# EAGLE design TapuinoNext (EAGLE 9.6.2)
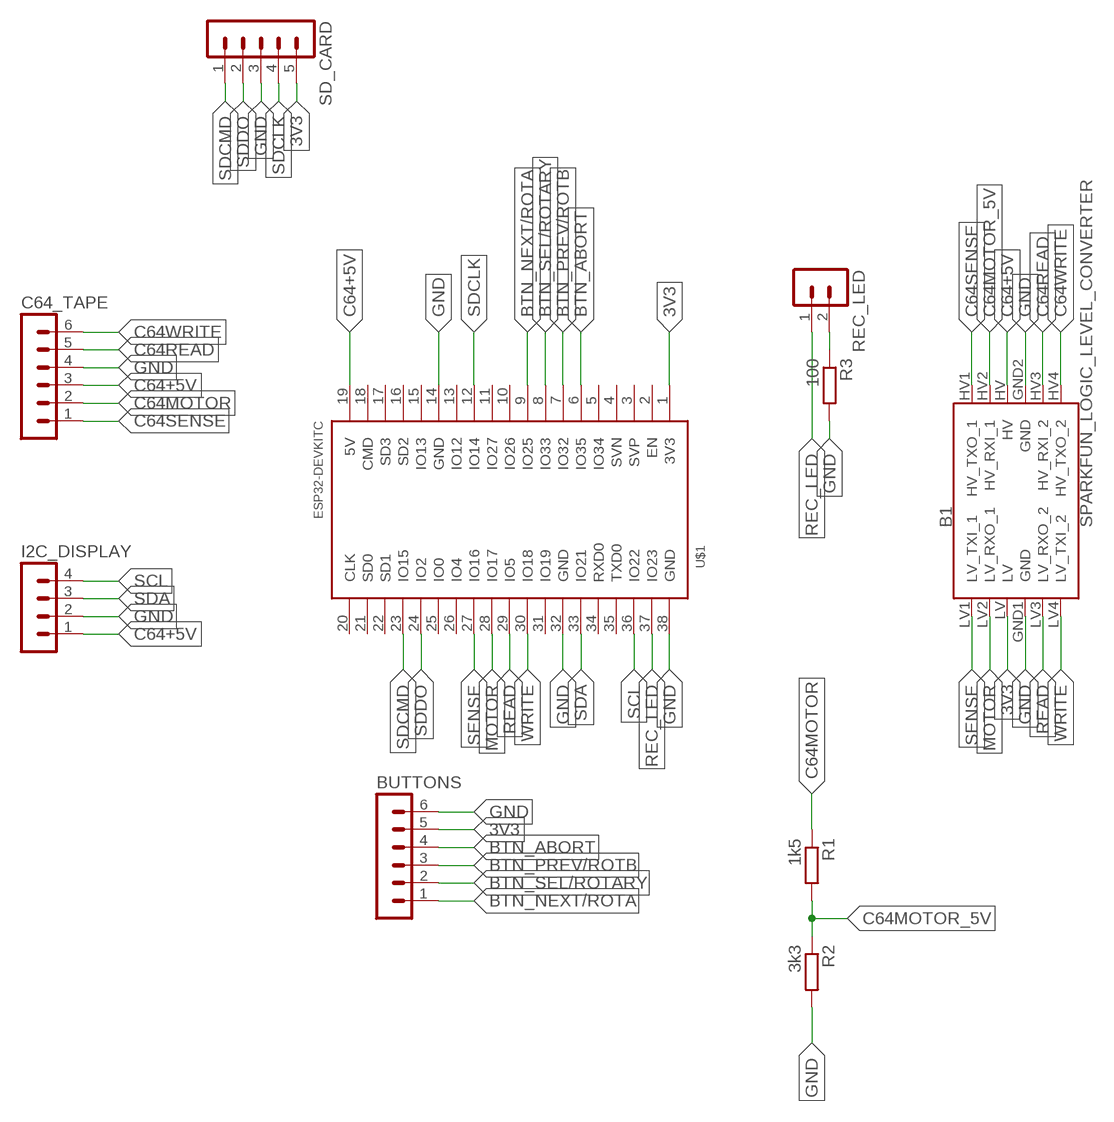
[diagram p0: schematic, sheet 1]

## Parts
B1  SPARKFUN_LOGIC_LEVEL_CONVERTER  [SPARKFUN_LOGIC_LEVEL_CONVERTER]
BUTTONS  MA06-1  [MA06-1]
C64_TAPE  MA06-1  [MA06-1]
I2C_DISPLAY  MA04-1  [MA04-1]
R1  1k5  R-EU_0204/7  [0204/7]
R2  3k3  R-EU_0204/7  [0204/7]
R3  100  R-EU_0204/7  [0204/7]
REC_LED  MA02-1  [MA02-1]
SD_CARD  MA05-1  [MA05-1]
U$1  ESP32DEVKITC  [ESP32-DEVKITC]

## Nets
3V3: B1.LV BUTTONS.5 SD_CARD.5 U$1.1(3V3)
BTN_ABORT: BUTTONS.4 U$1.6(IO35)
BTN_NEXT/ROTA: BUTTONS.1 U$1.9(IO25)
BTN_PREV/ROTB: BUTTONS.3 U$1.7(IO32)
BTN_SEL/ROTARY: BUTTONS.2 U$1.8(IO33)
C64+5V: B1.HV C64_TAPE.3 I2C_DISPLAY.1 U$1.19(5V)
C64MOTOR: C64_TAPE.2 R1.1
C64MOTOR_5V: B1.HV2(HV_RXI_1) R1.2 R2.1
C64READ: B1.HV3(HV_RXI_2) C64_TAPE.5
C64SENSE: B1.HV1(HV_TXO_1) C64_TAPE.1
C64WRITE: B1.HV4(HV_TXO_2) C64_TAPE.6
GND: B1.GND1(GND) B1.GND2(GND) BUTTONS.6 C64_TAPE.4 I2C_DISPLAY.2 R2.2 R3.2 SD_CARD.3 U$1.14(GND) U$1.32(GND) U$1.38(GND)
MOTOR: B1.LV2(LV_RXO_1) U$1.28(IO17)
N$2: R3.1 REC_LED.2
READ: B1.LV3(LV_RXO_2) U$1.29(IO5)
REC_LED: REC_LED.1 U$1.37(IO23)
SCL: I2C_DISPLAY.4 U$1.36(IO22)
SDA: I2C_DISPLAY.3 U$1.33(IO21)
SDCLK: SD_CARD.4 U$1.12(IO14)
SDCMD: SD_CARD.1 U$1.23(IO15)
SDDO: SD_CARD.2 U$1.24(IO2)
SENSE: B1.LV1(LV_TXI_1) U$1.27(IO16)
WRITE: B1.LV4(LV_TXI_2) U$1.30(IO18)
Unconnected: U$1.2(EN) U$1.3(SVP) U$1.4(SVN) U$1.5(IO34) U$1.10(IO26) U$1.11(IO27) U$1.13(IO12) U$1.15(IO13) U$1.16(SD2) U$1.17(SD3) U$1.18(CMD) U$1.20(CLK) U$1.21(SD0) U$1.22(SD1) U$1.25(IO0) U$1.26(IO4) U$1.31(IO19) U$1.34(RXD0) U$1.35(TXD0)

## Library data of the parts
B1 = SparkFun-Boards:SPARKFUN_LOGIC_LEVEL_CONVERTER: SparkFun Logic Level Converter -Bi-Directional This is the mechnical outline for the 3.3V - 5V bi directional logic level converter. *Note, the "LOCK" Package has the header pins staggered by an offset of 5 mils (off center line), so that when you slide a row of standard 0.1" headers into the PTH pads, it will hold position vertically. See the follwing turorial for more information on this type of special footprints: Sneaky Footprints <https://www.sparkfun.com/tutorials/114> SparkFun Products: SparkFun Logic Level Converter - Bi-Directional <https://www.sparkfun.com/products/12009>
BUTTONS C64_TAPE = con-lstb:MA06-1: PIN HEADER; OC_FARNELL: unknown; OC_NEWARK: unknown
I2C_DISPLAY = con-lstb:MA04-1: PIN HEADER; OC_FARNELL: unknown; OC_NEWARK: unknown
R1-R3 = rcl:R-EU_: RESISTOR, European symbol; SPICEPREFIX: R
REC_LED = con-lstb-ext:MA02-1: PIN HEADER; OC_FARNELL: unknown; OC_NEWARK: unknown
SD_CARD = con-lstb:MA05-1: PIN HEADER; OC_FARNELL: unknown; OC_NEWARK: unknown
U$1 = ESP32-DEVKITC:ESP32DEVKITC

## Board
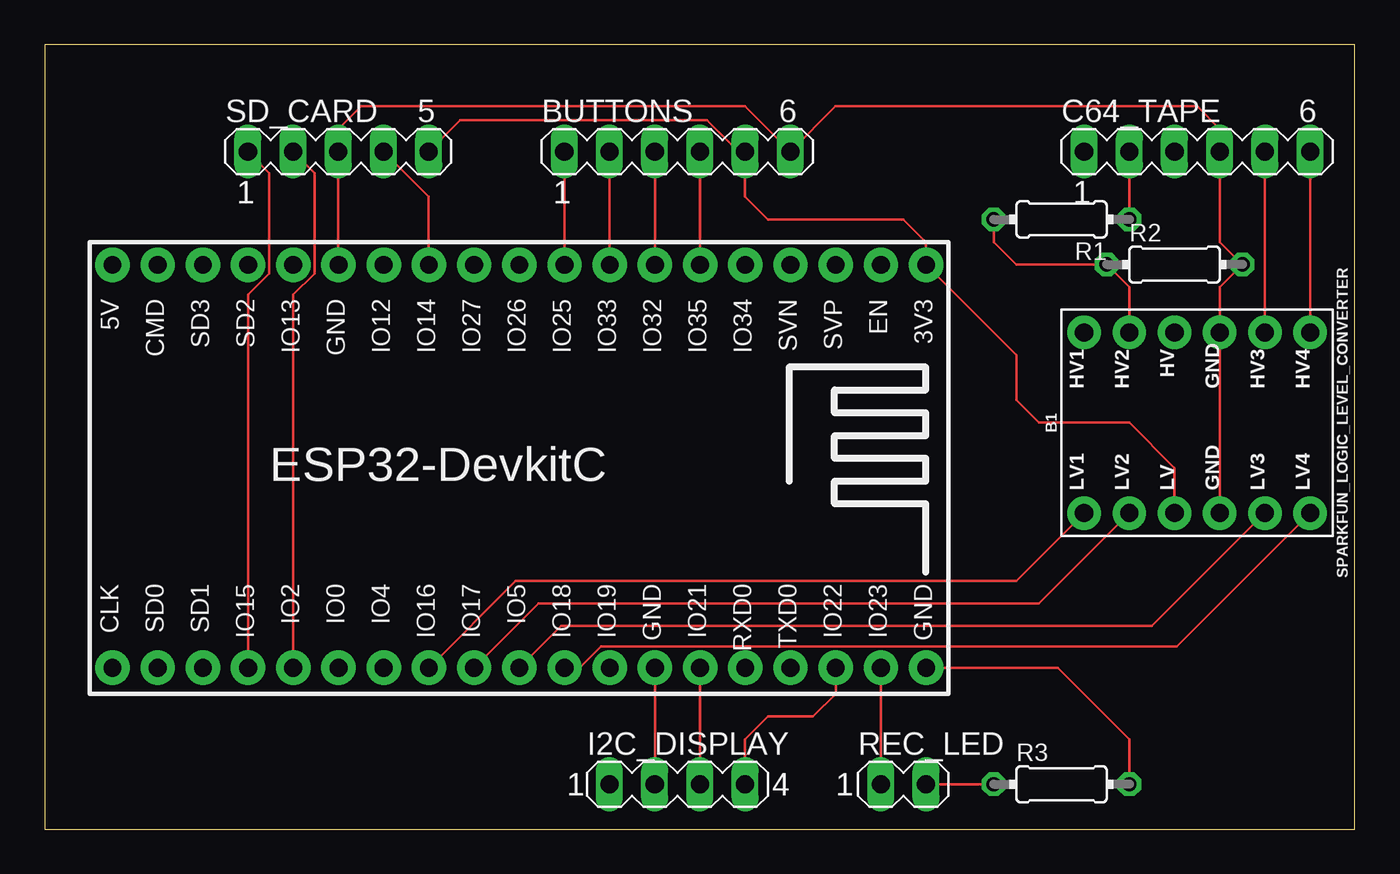
[diagram p1: board, top side]
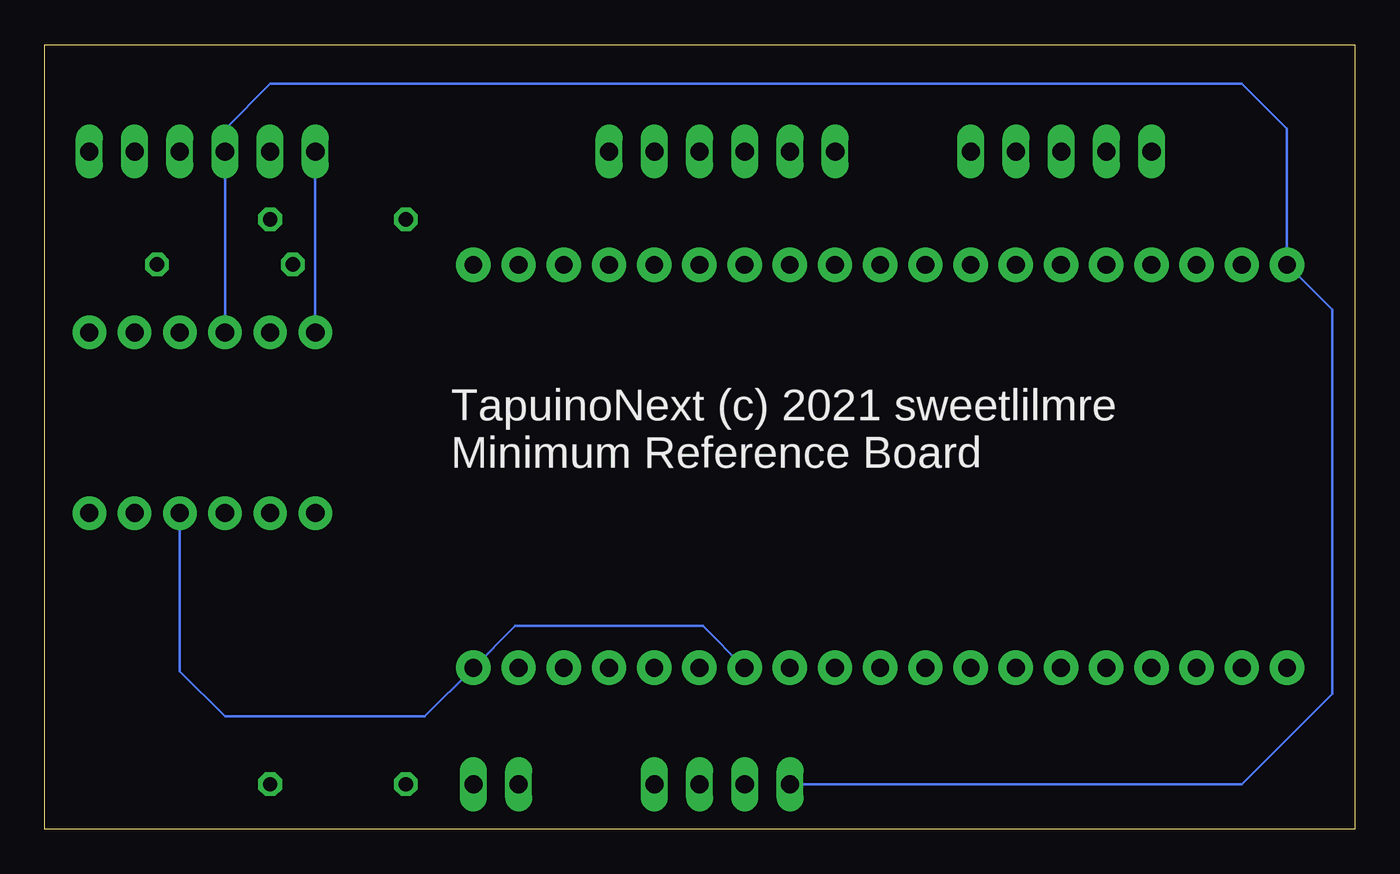
[diagram p2: board, bottom side, seen from below]

Size 73.64 x 44.12 mm. Coordinates in mm from the lower left corner, seen from the top.
Outline: 0,0 73.64,0 73.64,44.12 0,44.12 0,0
Copper layers (1*16): Top 0.035mm / dielectric 1.5mm / Bottom 0.035mm
Design rules "default": minimum track width 6mil, minimum drill 0.35mm, track to track 6mil, track to pad 6mil, pad to pad 6mil, via to via 6mil, smd to smd 6mil, copper to edge 40mil, drill to drill 6mil, minimum pad ring 10mil, minimum via ring 8mil, stop-mask expansion 4mil, vias tented up to drill 0mil, thermal gap 10mil

### Footprints (pad centres in the part's own frame; a part is rotated, then mirrored left to right if it is on the bottom)
SPARKFUN_LOGIC_LEVEL_CONVERTER = drill 1.016 pad 1.88: GND1 -5.08,-1.27; GND2 5.08,-1.27; HV 5.08,1.27; HV1 5.08,6.35; HV2 5.08,3.81; HV3 5.08,-3.81; HV4 5.08,-6.35; LV -5.08,1.27; LV1 -5.08,6.35; LV2 -5.08,3.81; LV3 -5.08,-3.81; LV4 -5.08,-6.35
MA06-1 = drill 1.016 long: 1 -6.35,0; 2 -3.81,0; 3 -1.27,0; 4 1.27,0; 5 3.81,0; 6 6.35,0
MA04-1 = drill 1.016 long: 1 -3.81,0; 2 -1.27,0; 3 1.27,0; 4 3.81,0
0204/7 = drill 0.813 octagon: 1 -3.81,0; 2 3.81,0
MA02-1 = drill 1.016 long: 1 -2.54,0; 2 0,0
MA05-1 = drill 1.016 long: 1 -5.08,0; 2 -2.54,0; 3 0,0; 4 2.54,0; 5 5.08,0
ESP32-DEVKITC = drill 1 pad 1.93: 1 -22.87,-11.42; 2 -20.33,-11.42; 3 -17.79,-11.42; 4 -15.25,-11.42; 5 -12.71,-11.42; 6 -10.17,-11.42; 7 -7.63,-11.42; 8 -5.09,-11.42; 9 -2.55,-11.42; 10 -0.01,-11.42; 11 2.53,-11.42; 12 5.07,-11.42; 13 7.61,-11.42; 14 10.15,-11.42; 15 12.69,-11.42; 16 15.23,-11.42; 17 17.77,-11.42; 18 20.31,-11.42; 19 22.85,-11.42; 20 22.85,11.23; 21 20.31,11.23; 22 17.77,11.23; 23 15.23,11.23; 24 12.69,11.23; 25 10.15,11.23; 26 7.61,11.23; 27 5.07,11.23; 28 2.53,11.23; 29 -0.01,11.23; 30 -2.55,11.23; 31 -5.09,11.23; 32 -7.63,11.23; 33 -10.17,11.23; 34 -12.71,11.23; 35 -15.25,11.23; 36 -17.79,11.23; 37 -20.33,11.23; 38 -22.87,11.23

### Placement (x,y rotation side)
B1  64.77,22.86 90 top
BUTTONS  35.56,38.1 0 top
C64_TAPE  64.77,38.1 0 top
I2C_DISPLAY  35.56,2.54 0 top
R1  57.15,34.29 180 top
R2  63.5,31.75 0 top
R3  57.15,2.54 0 top
REC_LED  49.53,2.54 0 top
SD_CARD  16.51,38.1 0 top
U$1  26.67,20.32 180 top

### Tracks (layer width: path | path; a pad name or v marks a point on that pad's centre or on a via)
3V3
  Top 0.152: B1.LV 63.5,20.32 60.96,22.86 55.88,22.86 54.61,24.13 54.61,26.67 U$1.1 49.54,33.01 48.26,34.29 40.64,34.29 39.37,35.56 BUTTONS.5 38.99,38.1 37.24,39.85 36.83,39.85 23.34,39.85 SD_CARD.5
BTN_ABORT
  Top 0.152: BUTTONS.4 U$1.6
BTN_NEXT/ROTA
  Top 0.152: BUTTONS.1 U$1.9
BTN_PREV/ROTB
  Top 0.152: BUTTONS.3 U$1.7
BTN_SEL/ROTARY
  Top 0.152: BUTTONS.2 U$1.8
C64+5V
  Bottom 0.152: B1.HV C64_TAPE.3 63.5,39.37 60.96,41.91 6.35,41.91 3.82,39.38 U$1.19 3.8,31.74 1.27,29.21 1.27,7.62 6.35,2.54 I2C_DISPLAY.1
C64MOTOR
  Top 0.152: C64_TAPE.2 R1.1
C64MOTOR_5V
  Top 0.152: B1.HV2 60.96,30.48 R2.1 54.61,31.75 53.34,33.02 R1.2
C64READ
  Top 0.152: C64_TAPE.5 B1.HV3
C64SENSE
  Bottom 0.152: C64_TAPE.1 B1.HV1
C64WRITE
  Top 0.152: C64_TAPE.6 B1.HV4
GND
  Top 0.152: U$1.32 I2C_DISPLAY.2 | B1.GND1 B1.GND2 66.04,30.48 R2.2 66.04,33.02 C64_TAPE.4 66.04,39.37 64.77,40.64 44.45,40.64 BUTTONS.6 39.37,40.64 17.78,40.64 16.51,39.37 SD_CARD.3 U$1.14 | U$1.38 56.95,9.09 60.96,5.08 R3.2
  Bottom 0.152: B1.GND1 66.04,8.89 63.5,6.35 52.28,6.35 U$1.38 47.2,11.43 36.64,11.43 U$1.32 | 65.66,38.1 C64_TAPE.4
MOTOR
  Top 0.152: B1.LV2 55.88,12.7 27.75,12.7 U$1.28
N$2
  Top 0.152: REC_LED.2 R3.1
READ
  Top 0.152: U$1.29 29.02,11.43 62.23,11.43 B1.LV3
REC_LED
  Top 0.152: REC_LED.1 U$1.37
SCL
  Top 0.152: I2C_DISPLAY.4 39.37,5.08 40.64,6.35 43.18,6.35 44.46,7.63 U$1.36
SDA
  Top 0.152: U$1.33 I2C_DISPLAY.3
SDCLK
  Top 0.152: U$1.12 21.59,35.56 SD_CARD.4
SDCMD
  Top 0.152: U$1.23 11.44,30.05 12.63,31.25 12.63,36.9 SD_CARD.1
SDDO
  Top 0.152: U$1.24 13.98,30.05 15.17,31.25 15.17,36.9 SD_CARD.2
SENSE
  Top 0.152: U$1.27 26.48,13.97 54.61,13.97 B1.LV1
WRITE
  Top 0.152: U$1.30 30.07,9.09 31.27,10.28 63.62,10.28 B1.LV4

### Text on the board
bPlace: TapuinoNext (c) 2021 sweetlilmre / Minimum Reference Board